# Altium schematic sheet io.schdoc: IO
size A4; Date: 04.10.2026; CheckedBy: BCY; DrawnBy: miaow; Revision: v1.0.0; SheetNumber: 15; SheetTotal: 15; BoardType: MAIN_PCB; Desc: FPC & header
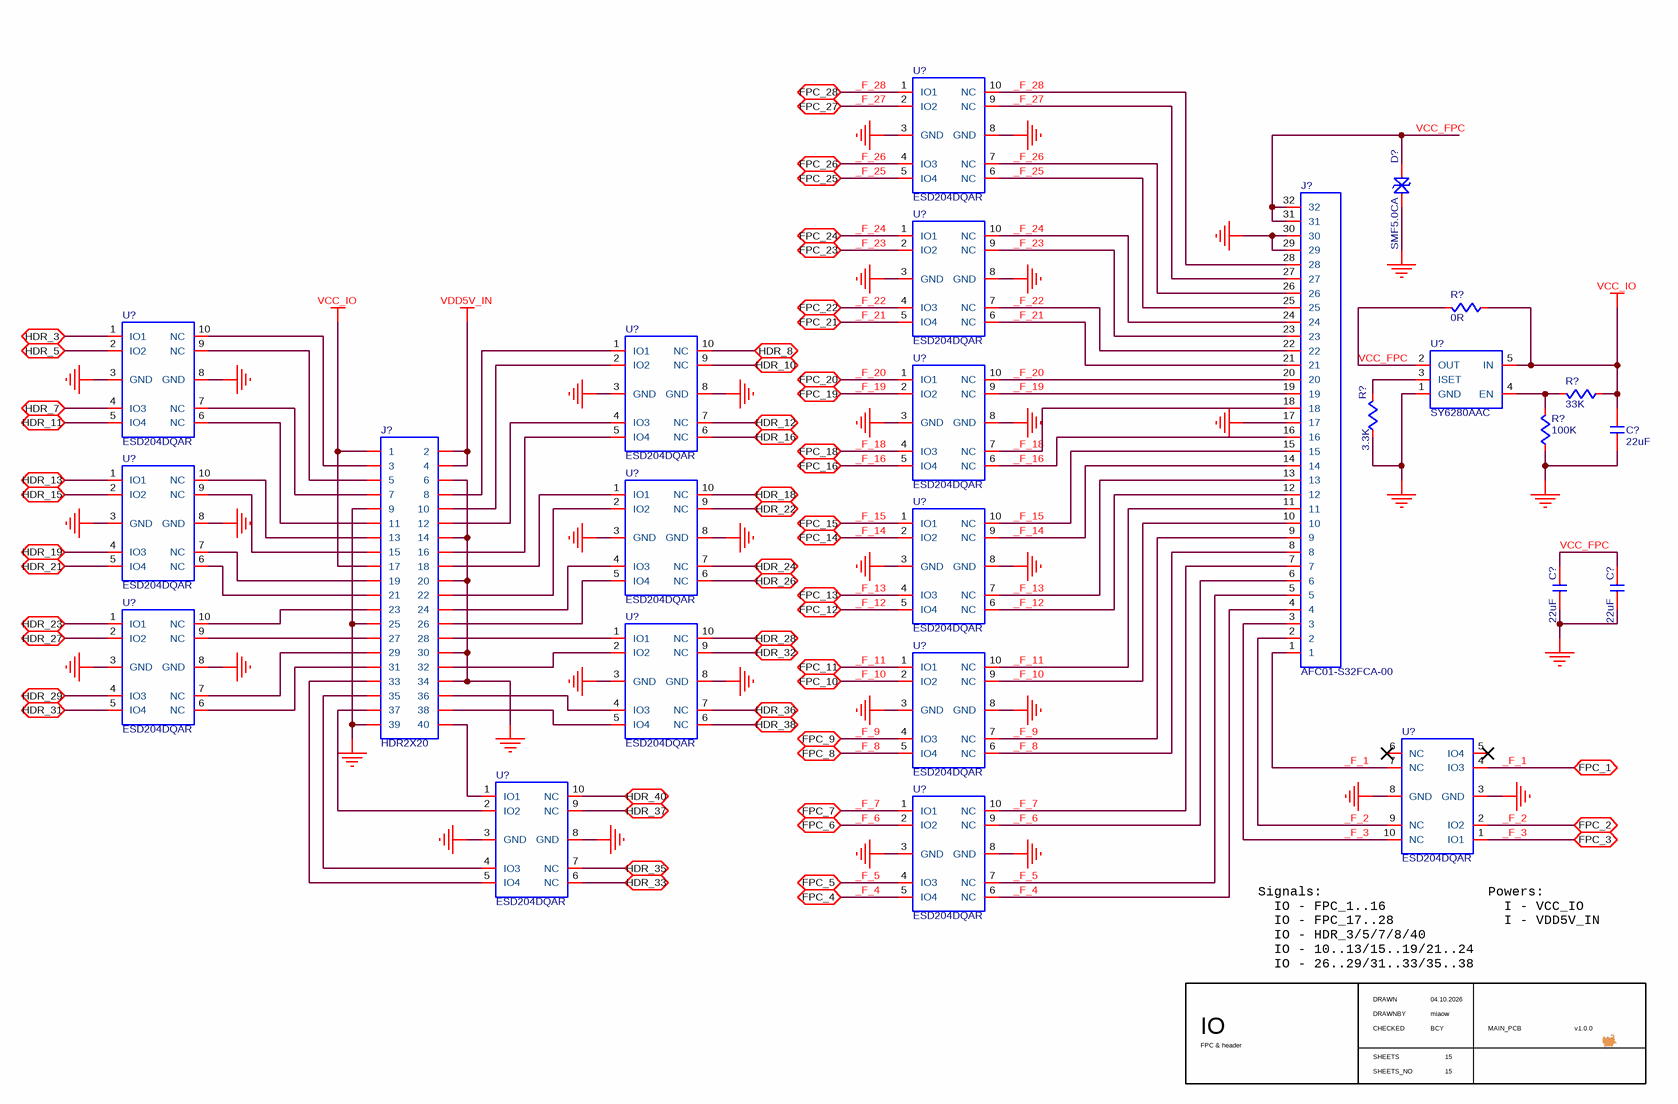
[diagram p0: io.schdoc]

## Parts
(Parts that share a designator on the sheet are numbered #1, #2 ... from top to bottom, then left to right.)
C?#1  value 22uF  [C0603]  (hidden comment: C-NOMO)
C?#2  value 22uF  [C0603]  (hidden comment: C-NOMO)
C?#3  value 22uF  [C0603]  (hidden comment: C-NOMO)
D?  SMF5.0CA  [SMF5.0CA]
J?#1  HDR2X20  [HDR2X20]
J?#2  AFC01-S32FCA-00  [AFC01-S32FCA-00]
R?#1  value 0R  [R1206]  (hidden comment: R)
R?#2  value 33K  [R0402]  (hidden comment: R)
R?#3  value 3.3K  [R0402]  (hidden comment: R)
R?#4  value 100K  [R0402]  (hidden comment: R)
U?#1  ESD204DQAR  [ESD204DQAR]
U?#2  ESD204DQAR  [ESD204DQAR]
U?#3  ESD204DQAR  [ESD204DQAR]
U?#4  ESD204DQAR  [ESD204DQAR]
U?#5  SY6280AAC  [SY6280AAC]
U?#6  ESD204DQAR  [ESD204DQAR]
U?#7  ESD204DQAR  [ESD204DQAR]
U?#8  ESD204DQAR  [ESD204DQAR]
U?#9  ESD204DQAR  [ESD204DQAR]
U?#10  ESD204DQAR  [ESD204DQAR]
U?#11  ESD204DQAR  [ESD204DQAR]
U?#12  ESD204DQAR  [ESD204DQAR]
U?#13  ESD204DQAR  [ESD204DQAR]
U?#14  ESD204DQAR  [ESD204DQAR]
U?#15  ESD204DQAR  [ESD204DQAR]

## Ports
FPC_1 (bidir), FPC_2 (bidir), FPC_3 (bidir), FPC_4 (bidir), FPC_5 (bidir), FPC_6 (bidir), FPC_7 (bidir), FPC_8 (bidir), FPC_9 (bidir), FPC_10 (bidir), FPC_11 (bidir), FPC_12 (bidir), FPC_13 (bidir), FPC_14 (bidir), FPC_15 (bidir), FPC_16 (bidir), FPC_18 (bidir), FPC_19 (bidir), FPC_20 (bidir), FPC_21 (bidir), FPC_22 (bidir), FPC_23 (bidir), FPC_24 (bidir), FPC_25 (bidir), FPC_26 (bidir), FPC_27 (bidir), FPC_28 (bidir), HDR_3 (bidir), HDR_5 (bidir), HDR_7 (bidir), HDR_8 (bidir), HDR_10 (bidir), HDR_11 (bidir), HDR_12 (bidir), HDR_13 (bidir), HDR_15 (bidir), HDR_16 (bidir), HDR_18 (bidir), HDR_19 (bidir), HDR_21 (bidir), HDR_22 (bidir), HDR_23 (bidir), HDR_24 (bidir), HDR_26 (bidir), HDR_27 (bidir), HDR_28 (bidir), HDR_29 (bidir), HDR_31 (bidir), HDR_32 (bidir), HDR_33 (bidir), HDR_35 (bidir), HDR_36 (bidir), HDR_37 (bidir), HDR_38 (bidir), HDR_40 (bidir)

## Nets
GND: C?#1.1 C?#2.1 C?#3.1 D?.1 J?#1.6 J?#1.9 J?#1.14 J?#1.20 J?#1.25 J?#1.30 J?#1.34 J?#1.39 J?#2.17 J?#2.29 J?#2.30 R?#3.2 R?#4.2 U?#1.3(GND) U?#1.8(GND) U?#2.3(GND) U?#2.8(GND) U?#3.3(GND) U?#3.8(GND) U?#4.3(GND) U?#4.8(GND) U?#5.1(GND) U?#6.3(GND) U?#6.8(GND) U?#7.3(GND) U?#7.8(GND) U?#8.3(GND) U?#8.8(GND) U?#9.3(GND) U?#9.8(GND) U?#10.3(GND) U?#10.8(GND) U?#11.3(GND) U?#11.8(GND) U?#12.3(GND) U?#12.8(GND) U?#13.3(GND) U?#13.8(GND) U?#14.3(GND) U?#14.8(GND) U?#15.3(GND) U?#15.8(GND)
VCC_IO: C?#1.2 J?#1.1 J?#1.17 R?#1.2 R?#2.2 U?#5.5(IN)
VDD5V_IN: J?#1.2 J?#1.4
_F_1: J?#2.1 U?#15.4(IO3) U?#15.7(NC) ; port FPC_1
_F_2: J?#2.2 U?#15.2(IO2) U?#15.9(NC) ; port FPC_2
_F_3: J?#2.3 U?#15.1(IO1) U?#15.10(NC) ; port FPC_3
_F_4: J?#2.4 U?#14.5(IO4) U?#14.6(NC) ; port FPC_4
_F_5: J?#2.5 U?#14.4(IO3) U?#14.7(NC) ; port FPC_5
_F_6: J?#2.6 U?#14.2(IO2) U?#14.9(NC) ; port FPC_6
_F_7: J?#2.7 U?#14.1(IO1) U?#14.10(NC) ; port FPC_7
_F_8: J?#2.8 U?#12.5(IO4) U?#12.6(NC) ; port FPC_8
_F_9: J?#2.9 U?#12.4(IO3) U?#12.7(NC) ; port FPC_9
_F_10: J?#2.10 U?#12.2(IO2) U?#12.9(NC) ; port FPC_10
_F_11: J?#2.11 U?#12.1(IO1) U?#12.10(NC) ; port FPC_11
_F_12: J?#2.12 U?#9.5(IO4) U?#9.6(NC) ; port FPC_12
_F_13: J?#2.13 U?#9.4(IO3) U?#9.7(NC) ; port FPC_13
_F_14: J?#2.14 U?#9.2(IO2) U?#9.9(NC) ; port FPC_14
_F_15: J?#2.15 U?#9.1(IO1) U?#9.10(NC) ; port FPC_15
_F_16: J?#2.16 U?#6.5(IO4) U?#6.6(NC) ; port FPC_16
_F_18: J?#2.18 U?#6.4(IO3) U?#6.7(NC) ; port FPC_18
_F_19: J?#2.19 U?#6.2(IO2) U?#6.9(NC) ; port FPC_19
_F_20: J?#2.20 U?#6.1(IO1) U?#6.10(NC) ; port FPC_20
_F_21: J?#2.21 U?#2.5(IO4) U?#2.6(NC) ; port FPC_21
_F_22: J?#2.22 U?#2.4(IO3) U?#2.7(NC) ; port FPC_22
_F_23: J?#2.23 U?#2.2(IO2) U?#2.9(NC) ; port FPC_23
_F_24: J?#2.24 U?#2.1(IO1) U?#2.10(NC) ; port FPC_24
_F_25: J?#2.25 U?#1.5(IO4) U?#1.6(NC) ; port FPC_25
_F_26: J?#2.26 U?#1.4(IO3) U?#1.7(NC) ; port FPC_26
_F_27: J?#2.27 U?#1.2(IO2) U?#1.9(NC) ; port FPC_27
_F_28: J?#2.28 U?#1.1(IO1) U?#1.10(NC) ; port FPC_28
HDR_3: U?#3.1(IO1) ; port HDR_3
HDR_5: U?#3.2(IO2) ; port HDR_5
HDR_7: U?#3.4(IO3) ; port HDR_7
HDR_8: U?#4.10(NC) ; port HDR_8
HDR_10: U?#4.9(NC) ; port HDR_10
HDR_11: U?#3.5(IO4) ; port HDR_11
HDR_12: U?#4.7(NC) ; port HDR_12
HDR_13: U?#7.1(IO1) ; port HDR_13
HDR_15: U?#7.2(IO2) ; port HDR_15
HDR_16: U?#4.6(NC) ; port HDR_16
HDR_18: U?#8.10(NC) ; port HDR_18
HDR_19: U?#7.4(IO3) ; port HDR_19
HDR_21: U?#7.5(IO4) ; port HDR_21
HDR_22: U?#8.9(NC) ; port HDR_22
HDR_23: U?#10.1(IO1) ; port HDR_23
HDR_24: U?#8.7(NC) ; port HDR_24
HDR_26: U?#8.6(NC) ; port HDR_26
HDR_27: U?#10.2(IO2) ; port HDR_27
HDR_28: U?#11.10(NC) ; port HDR_28
HDR_29: U?#10.4(IO3) ; port HDR_29
HDR_31: U?#10.5(IO4) ; port HDR_31
HDR_32: U?#11.9(NC) ; port HDR_32
HDR_33: U?#13.6(NC) ; port HDR_33
HDR_35: U?#13.7(NC) ; port HDR_35
HDR_36: U?#11.7(NC) ; port HDR_36
HDR_37: U?#13.9(NC) ; port HDR_37
HDR_38: U?#11.6(NC) ; port HDR_38
HDR_40: U?#13.10(NC) ; port HDR_40
VCC_FPC: C?#2.2 C?#3.2 D?.2 J?#2.31 J?#2.32 R?#1.1 U?#5.2(OUT)
NetJ?#1_3: J?#1.3 U?#3.10(NC)
NetJ?#1_5: J?#1.5 U?#3.9(NC)
NetJ?#1_7: J?#1.7 U?#3.7(NC)
NetJ?#1_8: J?#1.8 U?#4.1(IO1)
NetJ?#1_10: J?#1.10 U?#4.2(IO2)
NetJ?#1_11: J?#1.11 U?#3.6(NC)
NetJ?#1_12: J?#1.12 U?#4.4(IO3)
NetJ?#1_13: J?#1.13 U?#7.10(NC)
NetJ?#1_15: J?#1.15 U?#7.9(NC)
NetJ?#1_16: J?#1.16 U?#4.5(IO4)
NetJ?#1_18: J?#1.18 U?#8.1(IO1)
NetJ?#1_19: J?#1.19 U?#7.7(NC)
NetJ?#1_21: J?#1.21 U?#7.6(NC)
NetJ?#1_22: J?#1.22 U?#8.2(IO2)
NetJ?#1_23: J?#1.23 U?#10.10(NC)
NetJ?#1_24: J?#1.24 U?#8.4(IO3)
NetJ?#1_26: J?#1.26 U?#8.5(IO4)
NetJ?#1_27: J?#1.27 U?#10.9(NC)
NetJ?#1_28: J?#1.28 U?#11.1(IO1)
NetJ?#1_29: J?#1.29 U?#10.7(NC)
NetJ?#1_31: J?#1.31 U?#10.6(NC)
NetJ?#1_32: J?#1.32 U?#11.2(IO2)
NetJ?#1_33: J?#1.33 U?#13.5(IO4)
NetJ?#1_35: J?#1.35 U?#13.4(IO3)
NetJ?#1_36: J?#1.36 U?#11.4(IO3)
NetJ?#1_37: J?#1.37 U?#13.2(IO2)
NetJ?#1_38: J?#1.38 U?#11.5(IO4)
NetJ?#1_40: J?#1.40 U?#13.1(IO1)
NetR?#2_1: R?#2.1 R?#4.1 U?#5.4(EN)
NetR?#3_1: R?#3.1 U?#5.3(ISET)

Not connected (* = marked no-connect by the designer): U?#15 5(IO4)* 6(NC)*

## Notes on the sheet
- (near U?#15) Signals:
  IO - FPC_1..16
  IO - FPC_17..28
  IO - HDR_3/5/7/8/40
  IO - 10..13/15..19/21..24
  IO - 26..29/31..33/35..38
- (near U?#15) Powers:
  I - VCC_IO
  I - VDD5V_IN
- DRAWN
- CHECKED
- DRAWNBY
- SHEETS
- SHEETS_NO

## Library data of the parts
C?#1-C?#3 = C-NOMO: voltage: 10V; precision: 5%
D? = SMF5.0CA: TVS/ESD; Supplier 1: LCSC; Supplier Part Number 1: C19077498
J?#2 = AFC01-S32FCA-00: FPC - flip, 32p, 0.5mm; Supplier 1: LCSC; Supplier Part Number 1: C262672
R?#1-R?#4 = R: precision: 1%
U?#1-U?#4 U?#6-U?#15 = ESD204DQAR: TVS/ESD - 4 ch, 3.6V, 5V, 0.55pF@1MHz, 30KV; Supplier 1: LCSC; Supplier Part Number 1: C553132
U?#5 = SY6280AAC: PWR SWITCH; Supplier 1: LCSC; Supplier Part Number 1: C55136
J?#1 = HDR2X20: Supplier 1: LCSC; Supplier Part Number 1: C124383